# EAGLE design mistral_humtemp_breakout0 (EAGLE 7.3.0)
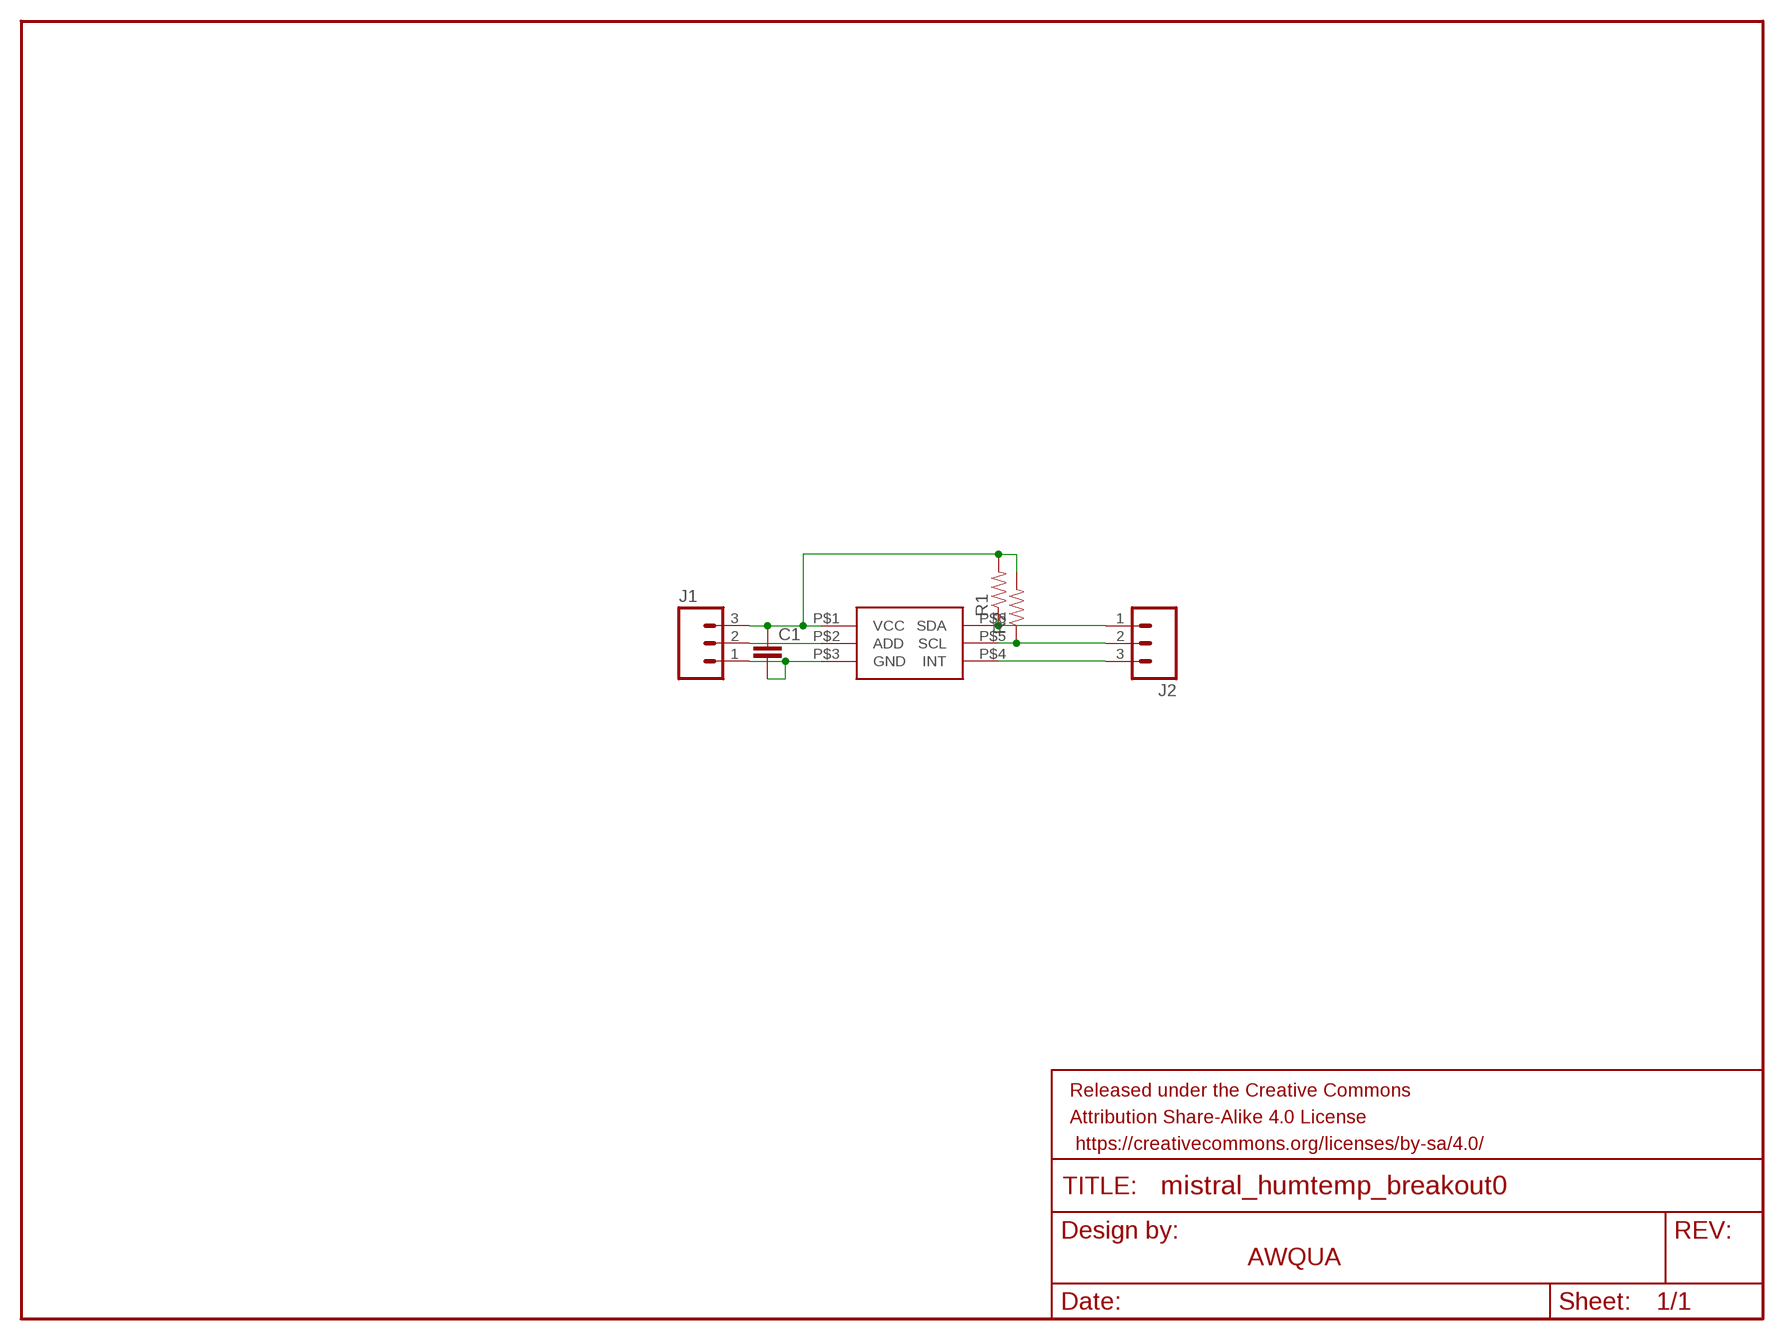
[diagram p0: schematic, sheet 1]

## Parts
C1  CAP0603-CAP  [0603-CAP]
FRAME1  FRAME-LETTER  [CREATIVE_COMMONS]
J1  M03PTH  [1X03]
J2  M03PTH  [1X03]
R1  RESISTOR0603-RES  [0603-RES]
R2  RESISTOR0603-RES  [0603-RES]
U$1  HDC2010  [HDC2010]

## Nets
ADD: J1.2 U$1.P$2(ADD)
GND: C1.2 J1.1 U$1.P$3(GND)
INT: J2.3 U$1.P$4(INT)
SCL: J2.2 R2.1 U$1.P$5(SCL)
SDA: J2.1 R1.1 U$1.P$6(SDA)
VCC: C1.1 J1.3 R1.2 R2.2 U$1.P$1(VCC)

## Notes on the sheet
- AWQUA

## Library data of the parts
C1 = SparkFun-Passives:CAP: Capacitor Standard 0603 ceramic capacitor, and 0.1" leaded capacitor.
FRAME1 = SparkFun-Aesthetics:FRAME-LETTER: Schematic Frame Standard 8.5x11 US Letter frame
J1 J2 = SparkFun-Connectors:M03: Header 3 Standard 3-pin 0.1" header. Use with straight break away headers (SKU : PRT-00116), right angle break away headers (PRT-00553), swiss pins (PRT-00743), machine pins (PRT-00117), and female headers (PRT-00115). Molex polarized connector foot print use with SKU : PRT-08232 with associated crimp pins and housings.
R1 R2 = SparkFun-Passives:RESISTOR: Resistor Basic schematic elements and footprints for 0603, 1206, and PTH resistors.
U$1 = awqua_eagle_library:HDC2010

## Board
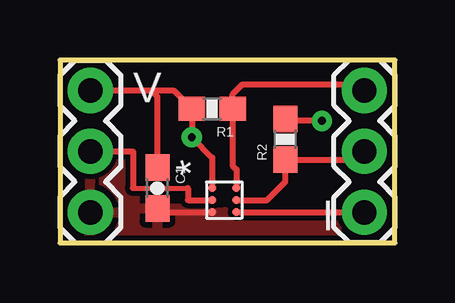
[diagram p1: board, top side]
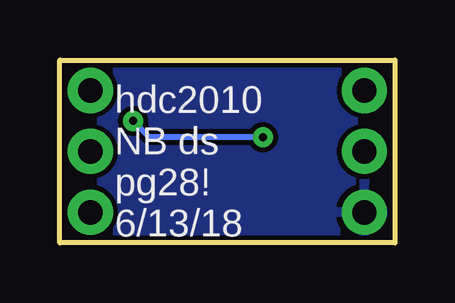
[diagram p2: board, bottom side, seen from below]

Size 13.97 x 7.62 mm. Coordinates in mm from the lower left corner, seen from the top.
Outline: 13.97,0 13.97,7.62 0,7.62 0,0 13.97,0
Copper layers (1*16): Top 0.035mm / dielectric 1.5mm / Bottom 0.035mm
Design rules "SparkFun *": minimum track width 8mil, minimum drill 12mil, track to track 8mil, track to pad 8mil, pad to pad 8mil, via to via 8mil, smd to smd 6mil, copper to edge 8mil, drill to drill 8mil, minimum pad ring 12mil, minimum via ring 10mil, stop-mask expansion 4mil, vias tented up to drill 25mil, thermal gap 10mil

### Footprints (pad centres in the part's own frame; a part is rotated, then mirrored left to right if it is on the bottom)
0603-CAP = smd 1.1 x 1: 1 -0.85,0; 2 0.85,0
1X03 = drill 1.016 pad 1.88: 1 0,0; 2 2.54,0; 3 5.08,0
0603-RES = smd 1.1 x 1: 1 -0.85,0; 2 0.85,0
HDC2010 = smd 0.333 x 0.333: P$1 -0.5,0.5; P$2 -0.5,0; P$3 -0.5,-0.5; P$4 0.5,-0.5; P$5 0.5,0; P$6 0.5,0.5

### Placement (x,y rotation side)
C1  4.06,2.29 270 top
FRAME1  -12.7,-19.56 0 top  (outside the outline)
J1  1.27,1.27 90 top
J2  12.7,6.35 270 top
R1  6.35,5.59 180 top
R2  9.4,4.32 90 top
U$1  6.86,1.78 0 top

### Tracks (layer width: path | path; a pad name or v marks a point on that pad's centre or on a via)
ADD
  Top 0.203: 3.05,2.29 5.33,2.29
  Top 0.254: J1.2 3.05,3.81 3.05,2.29 | 5.33,2.29 5.33,1.78 U$1.P$2
GND
  Top 0.254: C1.2 4.06,1.27 U$1.P$3
  pour Bottom: -8.89,50.8 48.26,50.8 48.26,-17.78 -8.89,-17.78
  pour Top: -7.62,49.53 50.8,49.53 50.8,-19.05 -7.62,-19.05
INT
  Top 0.254: U$1.P$4 J2.3
SCL
  Top 0.254: U$1.P$5 8.64,1.78 9.4,2.54 R2.1 12.36,3.47 J2.2
SDA
  Top 0.254: U$1.P$6 7.37,3.05 7.2,3.21 R1.1 7.2,6.18 7.62,6.6 12.45,6.6 J2.1
VCC  (via drill 0.33)
  Top 0.254: J1.3 3.81,6.35 | 3.81,6.35 4.74,6.35 R1.2 v5.5,4.41 6.35,3.56 U$1.P$1 | v10.92,5.08 9.49,5.08 R2.2 | C1.1 4.06,6.1 3.81,6.35
  Bottom 0.254: v5.5,4.41 10.25,4.41 v10.92,5.08

### Text on the board
tPlace: V | * | I
bPlace: hdc2010 / NB ds / pg28! / 6/13/18
tNames: AWQUA